# Altium schematic sheet PAGE4 - MOTOR_DRIVERS.SchDoc: Koruza move driver
size A4; DrawnBy: Matej Gomboc; DocumentNumber: 4; Revision: 1.0; SheetNumber: 4; SheetTotal: 4
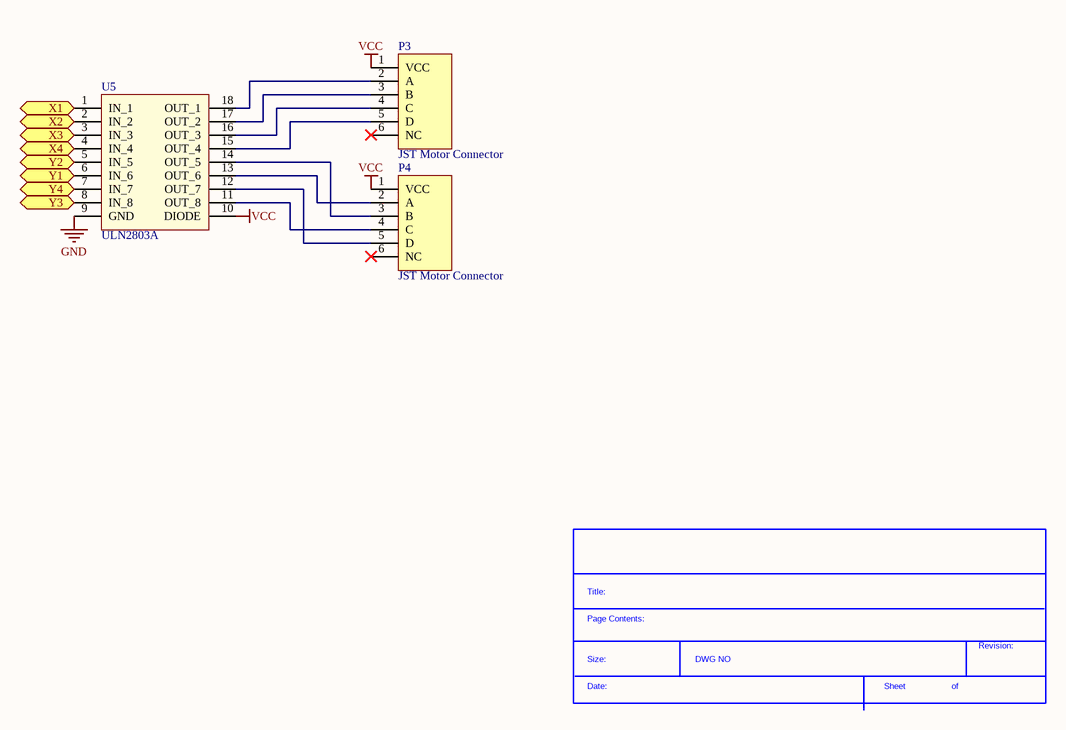
[diagram p0: PAGE4 - MOTOR_DRIVERS.SchDoc]

## Parts
*?  SDTitleBlock  (value not drawn)  (graphical)
P3  JST Motor Connector  [JST S6B-XH-SM4-TB - duplicate]
P4  JST Motor Connector  [JST S6B-XH-SM4-TB - duplicate]
U5  ULN2803A  [ULN2803A_SOIC18]

## Ports
X1, X2, X3, X4, Y1, Y2, Y3, Y4

## Nets
GND: U5.9(GND)
VCC: P3.1(VCC) P4.1(VCC) U5.10(DIODE)
X1: U5.1(IN_1) ; port X1
X2: U5.2(IN_2) ; port X2
X3: U5.3(IN_3) ; port X3
X4: U5.4(IN_4) ; port X4
Y1: U5.6(IN_6) ; port Y1
Y2: U5.5(IN_5) ; port Y2
Y3: U5.8(IN_8) ; port Y3
Y4: U5.7(IN_7) ; port Y4
NetP3_2: P3.2(A) U5.18(OUT_1)
NetP3_3: P3.3(B) U5.17(OUT_2)
NetP3_4: P3.4(C) U5.16(OUT_3)
NetP3_5: P3.5(D) U5.15(OUT_4)
NetP4_2: P4.2(A) U5.13(OUT_6)
NetP4_3: P4.3(B) U5.14(OUT_5)
NetP4_4: P4.4(C) U5.11(OUT_8)
NetP4_5: P4.5(D) U5.12(OUT_7)

Not connected (* = marked no-connect by the designer): P3 6(NC)*; P4 6(NC)*

## Notes on the sheet
- (in symbol SDTitleBlock) Title:; Page Contents:; Revision:; Size:; DWG NO; Date:; Sheet; of

## Library data of the parts
P3 P4 = motor_connector_2: JST unipolar motor connector
U5 = ULN2803A: Darlington array, 8 channels